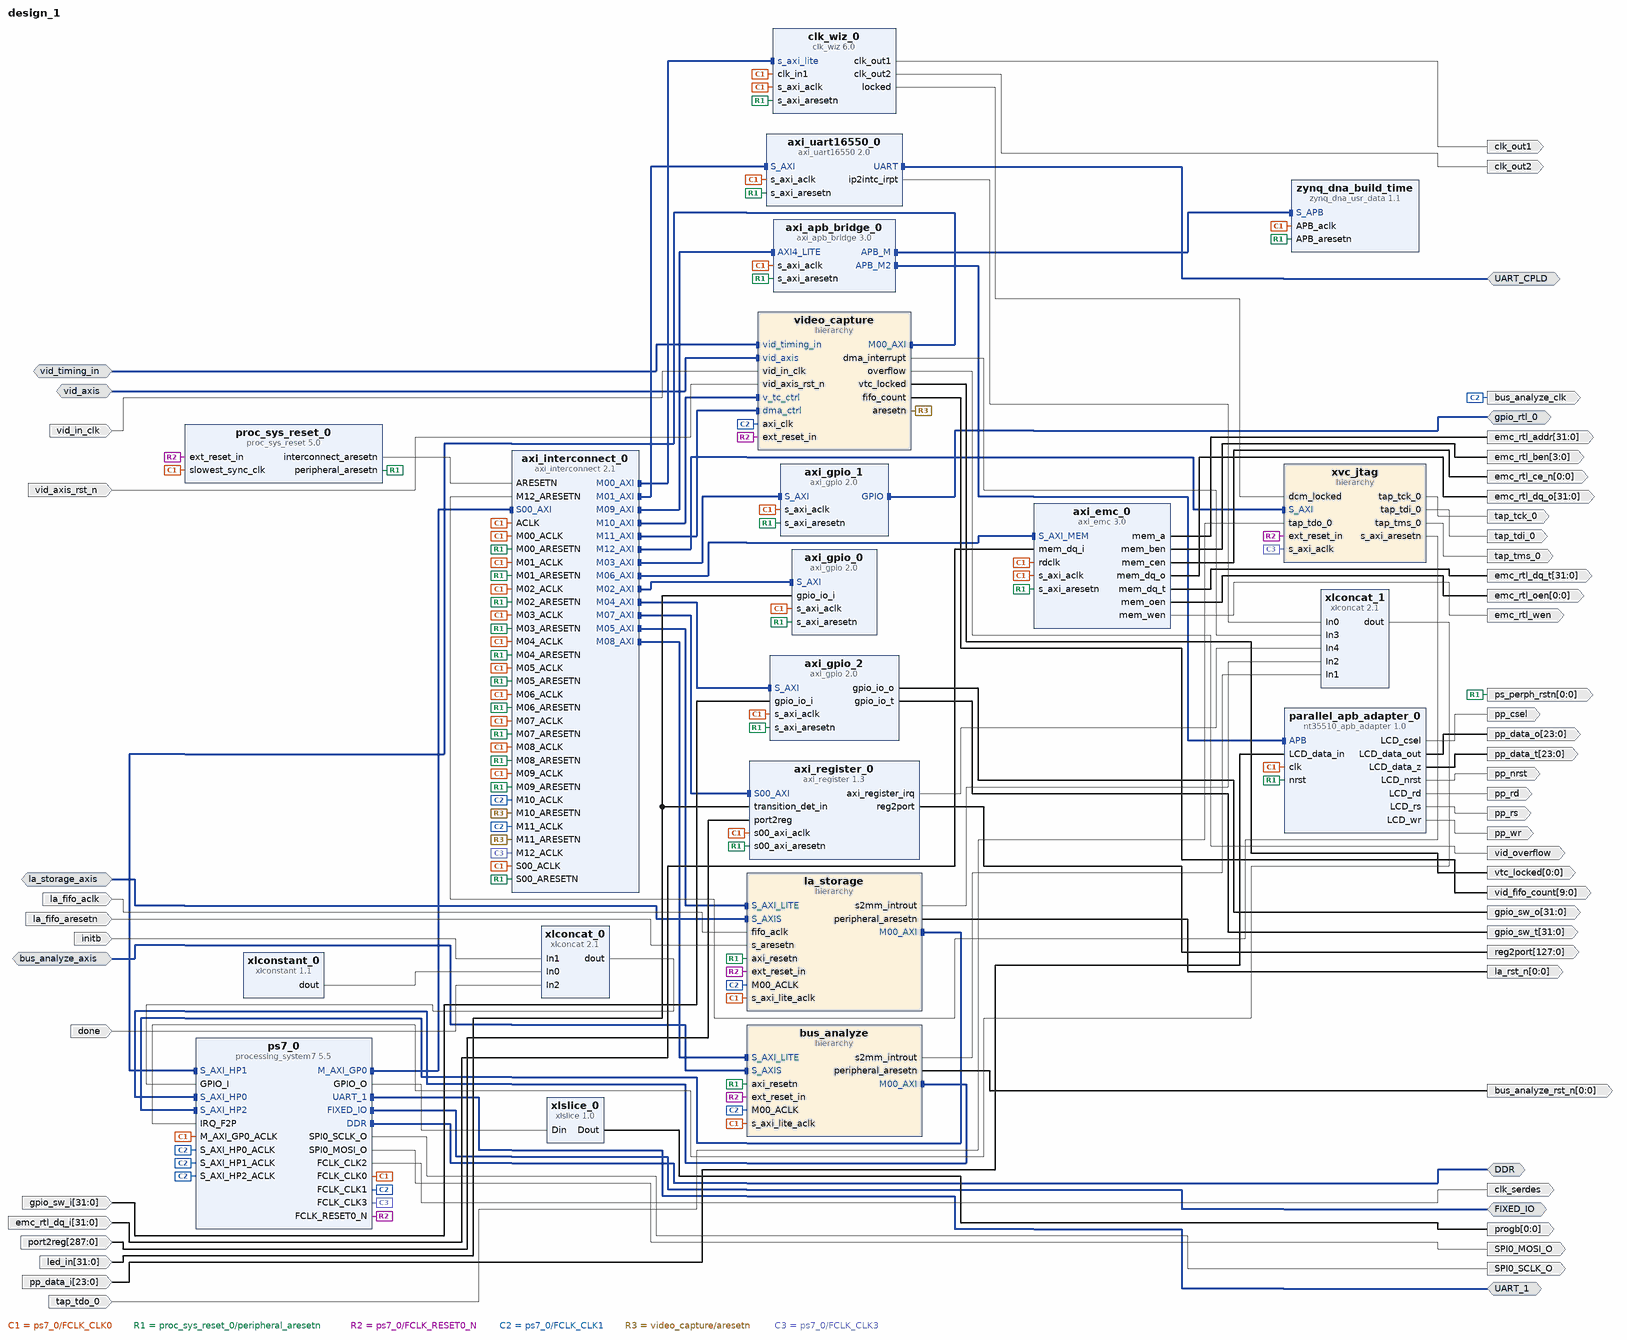
[diagram p0: block diagram of the top level]
# Vivado block design design_1, xc7z020clg484-1, Vivado 2018.3
create_bd_design design_1

create_bd_intf_port -mode Master -vlnv xilinx.com:interface:ddrx_rtl:1.0 DDR
create_bd_intf_port -mode Master -vlnv xilinx.com:display_processing_system7:fixedio_rtl:1.0 FIXED_IO
create_bd_intf_port -mode Master -vlnv xilinx.com:interface:uart_rtl:1.0 UART_1
create_bd_intf_port -mode Master -vlnv xilinx.com:interface:gpio_rtl:1.0 gpio_rtl_0
create_bd_intf_port -mode Slave -vlnv xilinx.com:interface:axis_rtl:1.0 bus_analyze_axis
set_property -dict [list \
  CONFIG.HAS_TKEEP 0 \
  CONFIG.HAS_TLAST 1 \
  CONFIG.HAS_TREADY 1 \
  CONFIG.HAS_TSTRB 0 \
  CONFIG.LAYERED_METADATA undef \
  CONFIG.TDATA_NUM_BYTES 16 \
  CONFIG.TDEST_WIDTH 0 \
  CONFIG.TID_WIDTH 0 \
  CONFIG.TUSER_WIDTH 0 \
] [get_bd_intf_ports bus_analyze_axis]
create_bd_intf_port -mode Slave -vlnv xilinx.com:interface:axis_rtl:1.0 la_storage_axis
set_property -dict [list \
  CONFIG.HAS_TKEEP 0 \
  CONFIG.HAS_TLAST 0 \
  CONFIG.HAS_TREADY 1 \
  CONFIG.HAS_TSTRB 0 \
  CONFIG.LAYERED_METADATA undef \
  CONFIG.TDATA_NUM_BYTES 32 \
  CONFIG.TDEST_WIDTH 0 \
  CONFIG.TID_WIDTH 0 \
  CONFIG.TUSER_WIDTH 0 \
] [get_bd_intf_ports la_storage_axis]
create_bd_intf_port -mode Master -vlnv xilinx.com:interface:uart_rtl:1.0 UART_CPLD
create_bd_intf_port -mode Slave -vlnv xilinx.com:interface:axis_rtl:1.0 vid_axis
set_property -dict [list \
  CONFIG.FREQ_HZ 150000000 \
  CONFIG.HAS_TKEEP 0 \
  CONFIG.HAS_TLAST 1 \
  CONFIG.HAS_TREADY 1 \
  CONFIG.HAS_TSTRB 0 \
  CONFIG.LAYERED_METADATA undef \
  CONFIG.TDATA_NUM_BYTES 1 \
  CONFIG.TDEST_WIDTH 0 \
  CONFIG.TID_WIDTH 0 \
  CONFIG.TUSER_WIDTH 1 \
] [get_bd_intf_ports vid_axis]
create_bd_intf_port -mode Slave -vlnv xilinx.com:interface:video_timing_rtl:2.0 vid_timing_in
create_bd_port -dir O -type clk clk_out1
create_bd_port -dir O -type clk clk_out2
create_bd_port -dir O -from 0 -to 0 ps_perph_rstn
create_bd_port -dir O SPI0_SCLK_O
create_bd_port -dir O -from 0 -to 0 progb
create_bd_port -dir I initb
create_bd_port -dir I done
create_bd_port -dir O SPI0_MOSI_O
create_bd_port -dir O -from 127 -to 0 -type data reg2port
create_bd_port -dir O -type clk bus_analyze_clk
set_property -dict [list \
  CONFIG.ASSOCIATED_BUSIF bus_analyze_axis \
  CONFIG.ASSOCIATED_RESET bus_analyze_rst_n \
] [get_bd_ports bus_analyze_clk]
create_bd_port -dir O -from 31 -to 0 emc_rtl_addr
create_bd_port -dir O -from 3 -to 0 emc_rtl_ben
create_bd_port -dir O -from 0 -to 0 emc_rtl_ce_n
create_bd_port -dir I -from 31 -to 0 emc_rtl_dq_i
create_bd_port -dir O -from 31 -to 0 emc_rtl_dq_o
create_bd_port -dir O -from 31 -to 0 emc_rtl_dq_t
create_bd_port -dir O -from 0 -to 0 emc_rtl_oen
create_bd_port -dir O emc_rtl_wen
create_bd_port -dir O -from 0 -to 0 -type rst bus_analyze_rst_n
create_bd_port -dir O -type clk clk_serdes
create_bd_port -dir I -type clk la_fifo_aclk
create_bd_port -dir I -type rst la_fifo_aresetn
create_bd_port -dir O -from 0 -to 0 -type rst la_rst_n
create_bd_port -dir I -from 287 -to 0 port2reg
create_bd_port -dir I -from 31 -to 0 gpio_sw_i
create_bd_port -dir O -from 31 -to 0 gpio_sw_o
create_bd_port -dir O -from 31 -to 0 gpio_sw_t
create_bd_port -dir O pp_nrst
create_bd_port -dir O pp_csel
create_bd_port -dir O pp_rs
create_bd_port -dir O pp_wr
create_bd_port -dir O pp_rd
create_bd_port -dir O -from 23 -to 0 pp_data_o
create_bd_port -dir O -from 23 -to 0 pp_data_t
create_bd_port -dir I -from 23 -to 0 pp_data_i
create_bd_port -dir I -type clk vid_in_clk
set_property -dict [list \
  CONFIG.ASSOCIATED_BUSIF vid_axis \
  CONFIG.ASSOCIATED_RESET vid_axis_rst_n \
  CONFIG.FREQ_HZ 150000000 \
] [get_bd_ports vid_in_clk]
create_bd_port -dir O vid_overflow
create_bd_port -dir O -from 0 -to 0 vtc_locked
create_bd_port -dir O tap_tdi_0
create_bd_port -dir O tap_tms_0
create_bd_port -dir O tap_tck_0
create_bd_port -dir I tap_tdo_0
create_bd_port -dir I -type rst vid_axis_rst_n
create_bd_port -dir O -from 9 -to 0 vid_fifo_count
create_bd_port -dir I -from 31 -to 0 -type data led_in

create_bd_cell -type hier bus_analyze
create_bd_cell -type hier la_storage
create_bd_cell -type ip -vlnv xilinx.com:ip:xlconcat:2.1 xlconcat_0
set_property -dict {CONFIG.NUM_PORTS 3 CONFIG.dout_width 3} [get_bd_cells xlconcat_0]
create_bd_cell -type ip -vlnv xilinx.com:ip:xlconcat:2.1 xlconcat_1
set_property -dict {CONFIG.NUM_PORTS 5 CONFIG.dout_width 5} [get_bd_cells xlconcat_1]
create_bd_cell -type ip -vlnv xilinx.com:ip:xlslice:1.0 xlslice_0
set_property -dict {CONFIG.DIN_FROM 0 CONFIG.DIN_TO 0 CONFIG.DIN_WIDTH 3} [get_bd_cells xlslice_0]
create_bd_cell -type ip -vlnv user.org:user:nt35510_apb_adapter:1.0 parallel_apb_adapter_0
set_property -dict {CONFIG.NT35510_RD_CYCLE 6 CONFIG.NT35510_RS_CYCLE 2} [get_bd_cells parallel_apb_adapter_0]
create_bd_cell -type hier video_capture
create_bd_cell -type ip -vlnv xilinx.com:ip:processing_system7:5.5 ps7_0
set_property -dict [list \
  CONFIG.PCW_APU_PERIPHERAL_FREQMHZ 666.666666 \
  CONFIG.PCW_ENET0_ENET0_IO {MIO 16 .. 27} \
  CONFIG.PCW_ENET0_GRP_MDIO_ENABLE 1 \
  CONFIG.PCW_ENET0_GRP_MDIO_IO {MIO 52 .. 53} \
  CONFIG.PCW_ENET0_PERIPHERAL_ENABLE 1 \
  CONFIG.PCW_ENET0_RESET_ENABLE 0 \
  CONFIG.PCW_ENET_RESET_ENABLE 1 \
  CONFIG.PCW_ENET_RESET_SELECT {Share reset pin} \
  CONFIG.PCW_EN_CLK1_PORT 1 \
  CONFIG.PCW_EN_CLK2_PORT 1 \
  CONFIG.PCW_EN_CLK3_PORT 1 \
  CONFIG.PCW_FCLK_CLK1_BUF TRUE \
  CONFIG.PCW_FCLK_CLK2_BUF TRUE \
  CONFIG.PCW_FCLK_CLK3_BUF TRUE \
  CONFIG.PCW_FPGA0_PERIPHERAL_FREQMHZ 50 \
  CONFIG.PCW_FPGA1_PERIPHERAL_FREQMHZ 100 \
  CONFIG.PCW_FPGA2_PERIPHERAL_FREQMHZ 200 \
  CONFIG.PCW_FPGA3_PERIPHERAL_FREQMHZ 10 \
  CONFIG.PCW_FPGA_FCLK1_ENABLE 1 \
  CONFIG.PCW_FPGA_FCLK2_ENABLE 1 \
  CONFIG.PCW_FPGA_FCLK3_ENABLE 1 \
  CONFIG.PCW_GP0_EN_MODIFIABLE_TXN 0 \
  CONFIG.PCW_GP1_EN_MODIFIABLE_TXN 0 \
  CONFIG.PCW_GPIO_EMIO_GPIO_ENABLE 1 \
  CONFIG.PCW_GPIO_EMIO_GPIO_IO 3 \
  CONFIG.PCW_GPIO_EMIO_GPIO_WIDTH 3 \
  CONFIG.PCW_GPIO_MIO_GPIO_ENABLE 1 \
  CONFIG.PCW_GPIO_MIO_GPIO_IO MIO \
  CONFIG.PCW_I2C_RESET_ENABLE 1 \
  CONFIG.PCW_IRQ_F2P_INTR 1 \
  CONFIG.PCW_M_AXI_GP0_FREQMHZ 50 \
  CONFIG.PCW_PERIPHERAL_BOARD_PRESET None \
  CONFIG.PCW_PRESET_BANK1_VOLTAGE {LVCMOS 2.5V} \
  CONFIG.PCW_QSPI_GRP_SINGLE_SS_ENABLE 1 \
  CONFIG.PCW_QSPI_GRP_SINGLE_SS_IO {MIO 1 .. 6} \
  CONFIG.PCW_QSPI_PERIPHERAL_ENABLE 1 \
  CONFIG.PCW_QSPI_QSPI_IO {MIO 1 .. 6} \
  CONFIG.PCW_SD0_GRP_CD_ENABLE 1 \
  CONFIG.PCW_SD0_GRP_CD_IO {MIO 48} \
  CONFIG.PCW_SD0_GRP_WP_ENABLE 0 \
  CONFIG.PCW_SD0_PERIPHERAL_ENABLE 1 \
  CONFIG.PCW_SD0_SD0_IO {MIO 40 .. 45} \
  CONFIG.PCW_SDIO_PERIPHERAL_FREQMHZ 50 \
  CONFIG.PCW_SINGLE_QSPI_DATA_MODE x4 \
  CONFIG.PCW_SPI0_PERIPHERAL_ENABLE 1 \
  CONFIG.PCW_SPI0_SPI0_IO EMIO \
  CONFIG.PCW_SPI_PERIPHERAL_FREQMHZ 166.666672 \
  CONFIG.PCW_S_AXI_HP0_FREQMHZ 100 \
  CONFIG.PCW_S_AXI_HP1_FREQMHZ 100 \
  CONFIG.PCW_S_AXI_HP2_FREQMHZ 100 \
  CONFIG.PCW_UART0_PERIPHERAL_ENABLE 1 \
  CONFIG.PCW_UART0_UART0_IO {MIO 46 .. 47} \
  CONFIG.PCW_UART1_PERIPHERAL_ENABLE 1 \
  CONFIG.PCW_UART1_UART1_IO EMIO \
  CONFIG.PCW_UART_PERIPHERAL_FREQMHZ 100 \
  CONFIG.PCW_UIPARAM_DDR_BUS_WIDTH {16 Bit} \
  CONFIG.PCW_UIPARAM_DDR_FREQ_MHZ 533.333333 \
  CONFIG.PCW_UIPARAM_DDR_MEMORY_TYPE {DDR 3 (Low Voltage)} \
  CONFIG.PCW_UIPARAM_DDR_PARTNO {MT41K256M16 RE-125} \
  CONFIG.PCW_USB0_PERIPHERAL_ENABLE 1 \
  CONFIG.PCW_USB0_RESET_ENABLE 1 \
  CONFIG.PCW_USB0_RESET_IO {MIO 49} \
  CONFIG.PCW_USB0_USB0_IO {MIO 28 .. 39} \
  CONFIG.PCW_USB_RESET_ENABLE 1 \
  CONFIG.PCW_USB_RESET_SELECT {Share reset pin} \
  CONFIG.PCW_USE_FABRIC_INTERRUPT 1 \
  CONFIG.PCW_USE_S_AXI_HP0 1 \
  CONFIG.PCW_USE_S_AXI_HP1 1 \
  CONFIG.PCW_USE_S_AXI_HP2 1 \
] [get_bd_cells ps7_0]
# 511 more settings of ps7_0 are not shown: defaults, MIO pin electricals, DDR timing, and values the tool derives
create_bd_cell -type hier xvc_jtag
create_bd_cell -type ip -vlnv xilinx.com:ip:axi_emc:3.0 axi_emc_0
set_property -dict [list \
  CONFIG.C_INCLUDE_DATAWIDTH_MATCHING_0 0 \
  CONFIG.C_MAX_MEM_WIDTH 32 \
  CONFIG.C_MEM0_TYPE 1 \
  CONFIG.C_MEM0_WIDTH 32 \
  CONFIG.C_S_AXI_EN_REG 0 \
] [get_bd_cells axi_emc_0]
create_bd_cell -type ip -vlnv xilinx.com:ip:axi_gpio:2.0 axi_gpio_0
set_property -dict [list \
  CONFIG.C_ALL_INPUTS 0 \
  CONFIG.C_ALL_OUTPUTS 0 \
  CONFIG.C_INTERRUPT_PRESENT 0 \
  CONFIG.C_IS_DUAL 0 \
] [get_bd_cells axi_gpio_0]
create_bd_cell -type ip -vlnv xilinx.com:ip:axi_gpio:2.0 axi_gpio_1
set_property -dict [list \
  CONFIG.C_ALL_INPUTS 0 \
  CONFIG.C_ALL_OUTPUTS 0 \
  CONFIG.C_GPIO_WIDTH 6 \
  CONFIG.C_INTERRUPT_PRESENT 0 \
  CONFIG.C_IS_DUAL 0 \
] [get_bd_cells axi_gpio_1]
create_bd_cell -type ip -vlnv xilinx.com:ip:axi_gpio:2.0 axi_gpio_2
set_property -dict [list \
  CONFIG.C_ALL_INPUTS 0 \
  CONFIG.C_ALL_OUTPUTS 0 \
  CONFIG.C_INTERRUPT_PRESENT 0 \
  CONFIG.C_IS_DUAL 0 \
] [get_bd_cells axi_gpio_2]
create_bd_cell -type ip -vlnv xilinx.com:ip:axi_interconnect:2.1 axi_interconnect_0
set_property -dict {CONFIG.NUM_MI 13 CONFIG.SYNCHRONIZATION_STAGES 2} [get_bd_cells axi_interconnect_0]
create_bd_cell -type ip -vlnv xilinx.com:ip:axi_uart16550:2.0 axi_uart16550_0
set_property -dict {CONFIG.C_S_AXI_ACLK_FREQ_HZ 50000000} [get_bd_cells axi_uart16550_0]
create_bd_cell -type ip -vlnv xilinx.com:ip:clk_wiz:6.0 clk_wiz_0
set_property -dict [list \
  CONFIG.CLKIN1_JITTER_PS 200.0 \
  CONFIG.CLKOUT1_DRIVES BUFGCE \
  CONFIG.CLKOUT1_JITTER 190.710 \
  CONFIG.CLKOUT1_PHASE_ERROR 163.922 \
  CONFIG.CLKOUT1_REQUESTED_OUT_FREQ 50 \
  CONFIG.CLKOUT2_DRIVES BUFGCE \
  CONFIG.CLKOUT2_JITTER 278.968 \
  CONFIG.CLKOUT2_PHASE_ERROR 163.922 \
  CONFIG.CLKOUT2_REQUESTED_OUT_FREQ 11.0592 \
  CONFIG.CLKOUT2_USED true \
  CONFIG.CLKOUT3_DRIVES BUFGCE \
  CONFIG.CLKOUT3_JITTER 264.801 \
  CONFIG.CLKOUT3_PHASE_ERROR 158.301 \
  CONFIG.CLKOUT3_REQUESTED_OUT_FREQ 11.0592 \
  CONFIG.CLKOUT3_USED false \
  CONFIG.CLKOUT4_DRIVES BUFGCE \
  CONFIG.CLKOUT5_DRIVES BUFGCE \
  CONFIG.CLKOUT6_DRIVES BUFGCE \
  CONFIG.CLKOUT7_DRIVES BUFGCE \
  CONFIG.FEEDBACK_SOURCE FDBK_AUTO \
  CONFIG.MMCM_CLKFBOUT_MULT_F 20.125 \
  CONFIG.MMCM_CLKIN1_PERIOD 20.000 \
  CONFIG.MMCM_CLKIN2_PERIOD 10.0 \
  CONFIG.MMCM_CLKOUT0_DIVIDE_F 20.125 \
  CONFIG.MMCM_CLKOUT1_DIVIDE 91 \
  CONFIG.MMCM_CLKOUT2_DIVIDE 1 \
  CONFIG.MMCM_COMPENSATION ZHOLD \
  CONFIG.MMCM_DIVCLK_DIVIDE 1 \
  CONFIG.NUM_OUT_CLKS 2 \
  CONFIG.PRIMITIVE MMCM \
  CONFIG.PRIM_SOURCE Global_buffer \
  CONFIG.USE_DYN_RECONFIG true \
  CONFIG.USE_SAFE_CLOCK_STARTUP true \
] [get_bd_cells clk_wiz_0]
create_bd_cell -type ip -vlnv xilinx.com:ip:proc_sys_reset:5.0 proc_sys_reset_0
create_bd_cell -type ip -vlnv xilinx.com:ip:xlconstant:1.1 xlconstant_0
set_property -dict {CONFIG.CONST_VAL 0} [get_bd_cells xlconstant_0]
create_bd_cell -type ip -vlnv user.org:user:zynq_dna_usr_data:1.1 zynq_dna_build_time
create_bd_cell -type ip -vlnv xilinx.com:ip:axi_apb_bridge:3.0 axi_apb_bridge_0
set_property -dict [list \
  CONFIG.C_APB_NUM_SLAVES 2 \
  CONFIG.C_DPHASE_TIMEOUT 64 \
  CONFIG.C_M_APB_PROTOCOL apb4 \
] [get_bd_cells axi_apb_bridge_0]
create_bd_cell -type ip -vlnv user.org:user:axi_register:1.3 axi_register_0

# ---- hierarchy /bus_analyze ----
current_bd_instance /bus_analyze
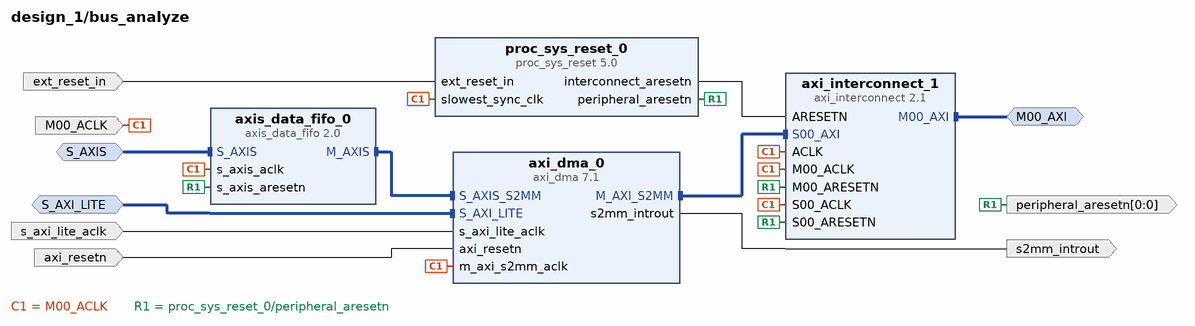
[diagram p1: block diagram inside /bus_analyze]
create_bd_intf_pin -mode Master -vlnv xilinx.com:interface:aximm_rtl:1.0 M00_AXI
create_bd_intf_pin -mode Slave -vlnv xilinx.com:interface:aximm_rtl:1.0 S_AXI_LITE
create_bd_intf_pin -mode Slave -vlnv xilinx.com:interface:axis_rtl:1.0 S_AXIS
create_bd_pin -dir I -type clk M00_ACLK
create_bd_pin -dir I -type clk s_axi_lite_aclk
create_bd_pin -dir I -type rst ext_reset_in
create_bd_pin -dir O -type intr s2mm_introut
create_bd_pin -dir I -type rst axi_resetn
create_bd_pin -dir O -from 0 -to 0 -type rst peripheral_aresetn

create_bd_cell -type ip -vlnv xilinx.com:ip:axi_dma:7.1 axi_dma_0
set_property -dict [list \
  CONFIG.c_include_mm2s 0 \
  CONFIG.c_include_s2mm 1 \
  CONFIG.c_include_sg 0 \
  CONFIG.c_m_axi_s2mm_data_width 128 \
  CONFIG.c_micro_dma 0 \
  CONFIG.c_s2mm_burst_size 32 \
  CONFIG.c_sg_length_width 23 \
] [get_bd_cells axi_dma_0]
create_bd_cell -type ip -vlnv xilinx.com:ip:axi_interconnect:2.1 axi_interconnect_1
set_property -dict {CONFIG.NUM_MI 1 CONFIG.NUM_SI 1 CONFIG.SYNCHRONIZATION_STAGES 2} [get_bd_cells axi_interconnect_1]
create_bd_cell -type ip -vlnv xilinx.com:ip:axis_data_fifo:2.0 axis_data_fifo_0
set_property -dict [list \
  CONFIG.FIFO_DEPTH 256 \
  CONFIG.HAS_RD_DATA_COUNT 1 \
  CONFIG.HAS_TKEEP 0 \
  CONFIG.HAS_WR_DATA_COUNT 1 \
  CONFIG.TDATA_NUM_BYTES 16 \
] [get_bd_cells axis_data_fifo_0]
create_bd_cell -type ip -vlnv xilinx.com:ip:proc_sys_reset:5.0 proc_sys_reset_0

# ---- hierarchy /la_storage ----
current_bd_instance /la_storage
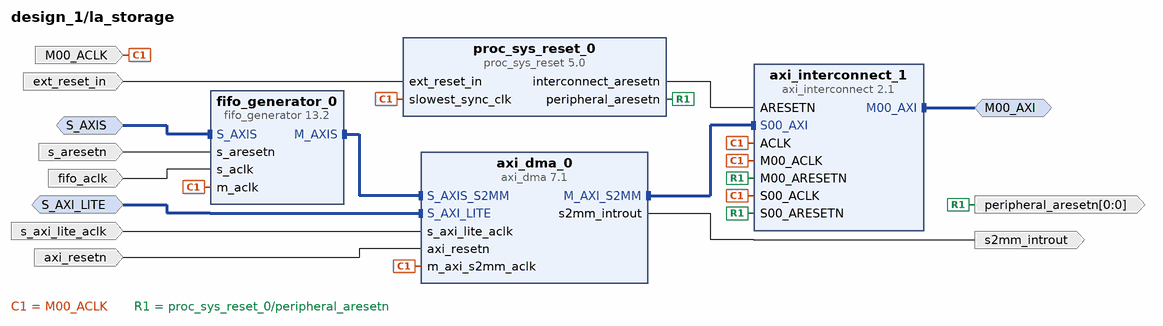
[diagram p2: block diagram inside /la_storage]
create_bd_intf_pin -mode Master -vlnv xilinx.com:interface:aximm_rtl:1.0 M00_AXI
create_bd_intf_pin -mode Slave -vlnv xilinx.com:interface:aximm_rtl:1.0 S_AXI_LITE
create_bd_intf_pin -mode Slave -vlnv xilinx.com:interface:axis_rtl:1.0 S_AXIS
create_bd_pin -dir I -type clk M00_ACLK
create_bd_pin -dir I -type clk s_axi_lite_aclk
create_bd_pin -dir I -type rst ext_reset_in
create_bd_pin -dir O -type intr s2mm_introut
create_bd_pin -dir I -type rst axi_resetn
create_bd_pin -dir O -from 0 -to 0 -type rst peripheral_aresetn
create_bd_pin -dir I -type clk fifo_aclk
create_bd_pin -dir I -type rst s_aresetn

create_bd_cell -type ip -vlnv xilinx.com:ip:axi_dma:7.1 axi_dma_0
set_property -dict [list \
  CONFIG.c_include_mm2s 0 \
  CONFIG.c_include_s2mm 1 \
  CONFIG.c_include_sg 0 \
  CONFIG.c_micro_dma 0 \
  CONFIG.c_s2mm_burst_size 32 \
  CONFIG.c_sg_length_width 23 \
] [get_bd_cells axi_dma_0]
create_bd_cell -type ip -vlnv xilinx.com:ip:axi_interconnect:2.1 axi_interconnect_1
set_property -dict {CONFIG.NUM_MI 1 CONFIG.NUM_SI 1 CONFIG.SYNCHRONIZATION_STAGES 2} [get_bd_cells axi_interconnect_1]
create_bd_cell -type ip -vlnv xilinx.com:ip:fifo_generator:13.2 fifo_generator_0
set_property -dict [list \
  CONFIG.Clock_Type_AXI Independent_Clock \
  CONFIG.Enable_TLAST true \
  CONFIG.FIFO_Implementation_axis Independent_Clocks_Block_RAM \
  CONFIG.FIFO_Implementation_rach Independent_Clocks_Distributed_RAM \
  CONFIG.FIFO_Implementation_rdch Independent_Clocks_Block_RAM \
  CONFIG.FIFO_Implementation_wach Independent_Clocks_Distributed_RAM \
  CONFIG.FIFO_Implementation_wdch Independent_Clocks_Block_RAM \
  CONFIG.FIFO_Implementation_wrch Independent_Clocks_Distributed_RAM \
  CONFIG.Full_Flags_Reset_Value 1 \
  CONFIG.INTERFACE_TYPE AXI_STREAM \
  CONFIG.Input_Depth_axis 1024 \
  CONFIG.TDATA_NUM_BYTES 32 \
  CONFIG.TUSER_WIDTH 0 \
] [get_bd_cells fifo_generator_0]
create_bd_cell -type ip -vlnv xilinx.com:ip:proc_sys_reset:5.0 proc_sys_reset_0

# ---- hierarchy /video_capture ----
current_bd_instance /video_capture
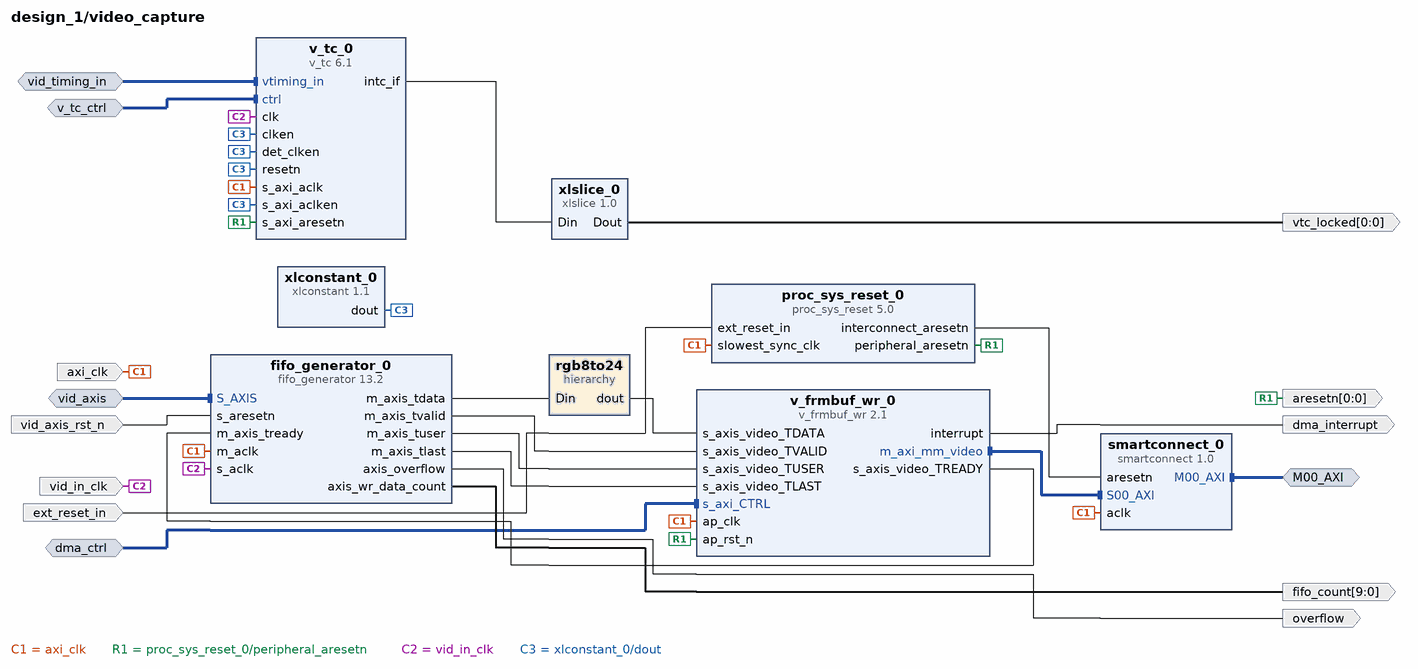
[diagram p3: block diagram inside /video_capture]
create_bd_intf_pin -mode Master -vlnv xilinx.com:interface:aximm_rtl:1.0 M00_AXI
create_bd_intf_pin -mode Slave -vlnv xilinx.com:interface:aximm_rtl:1.0 v_tc_ctrl
create_bd_intf_pin -mode Slave -vlnv xilinx.com:interface:aximm_rtl:1.0 dma_ctrl
create_bd_intf_pin -mode Slave -vlnv xilinx.com:interface:axis_rtl:1.0 vid_axis
create_bd_intf_pin -mode Slave -vlnv xilinx.com:interface:video_timing_rtl:2.0 vid_timing_in
create_bd_pin -dir I axi_clk
create_bd_pin -dir I vid_in_clk
create_bd_pin -dir O dma_interrupt
create_bd_pin -dir O -from 0 -to 0 aresetn
create_bd_pin -dir I ext_reset_in
create_bd_pin -dir O overflow
create_bd_pin -dir O -from 0 -to 0 vtc_locked
create_bd_pin -dir I -type rst vid_axis_rst_n
create_bd_pin -dir O -from 9 -to 0 fifo_count

create_bd_cell -type ip -vlnv xilinx.com:ip:xlslice:1.0 xlslice_0
set_property -dict {CONFIG.DIN_FROM 8 CONFIG.DIN_TO 8 CONFIG.DOUT_WIDTH 1} [get_bd_cells xlslice_0]
create_bd_cell -type hier rgb8to24
create_bd_cell -type ip -vlnv xilinx.com:ip:fifo_generator:13.2 fifo_generator_0
set_property -dict [list \
  CONFIG.Clock_Type_AXI Independent_Clock \
  CONFIG.Enable_Data_Counts_axis true \
  CONFIG.Enable_Safety_Circuit true \
  CONFIG.Enable_TLAST true \
  CONFIG.FIFO_Application_Type_axis Data_FIFO \
  CONFIG.FIFO_Implementation_axis Independent_Clocks_Block_RAM \
  CONFIG.FIFO_Implementation_rach Independent_Clocks_Distributed_RAM \
  CONFIG.FIFO_Implementation_rdch Independent_Clocks_Block_RAM \
  CONFIG.FIFO_Implementation_wach Independent_Clocks_Distributed_RAM \
  CONFIG.FIFO_Implementation_wdch Independent_Clocks_Block_RAM \
  CONFIG.FIFO_Implementation_wrch Independent_Clocks_Distributed_RAM \
  CONFIG.Full_Flags_Reset_Value 1 \
  CONFIG.INTERFACE_TYPE AXI_STREAM \
  CONFIG.Input_Depth_axis 512 \
  CONFIG.Overflow_Flag_AXI true \
  CONFIG.TUSER_WIDTH 1 \
] [get_bd_cells fifo_generator_0]
create_bd_cell -type ip -vlnv xilinx.com:ip:proc_sys_reset:5.0 proc_sys_reset_0
create_bd_cell -type ip -vlnv xilinx.com:ip:smartconnect:1.0 smartconnect_0
set_property -dict {CONFIG.NUM_SI 1} [get_bd_cells smartconnect_0]
create_bd_cell -type ip -vlnv xilinx.com:ip:v_frmbuf_wr:2.1 v_frmbuf_wr_0
set_property -dict [list \
  CONFIG.AXIMM_DATA_WIDTH 64 \
  CONFIG.C_M_AXI_MM_VIDEO_DATA_WIDTH 64 \
  CONFIG.MAX_COLS 2048 \
  CONFIG.MAX_ROWS 2018 \
  CONFIG.SAMPLES_PER_CLOCK 1 \
] [get_bd_cells v_frmbuf_wr_0]
create_bd_cell -type ip -vlnv xilinx.com:ip:v_tc:6.1 v_tc_0
set_property -dict [list \
  CONFIG.HAS_INTC_IF true \
  CONFIG.VIDEO_MODE 640x480p \
  CONFIG.enable_generation false \
  CONFIG.frame_syncs 1 \
  CONFIG.horizontal_blank_detection false \
  CONFIG.max_clocks_per_line 2048 \
  CONFIG.max_lines_per_frame 2048 \
  CONFIG.vertical_blank_detection false \
] [get_bd_cells v_tc_0]
create_bd_cell -type ip -vlnv xilinx.com:ip:xlconstant:1.1 xlconstant_0

# ---- hierarchy /video_capture/rgb8to24 ----
current_bd_instance /video_capture/rgb8to24
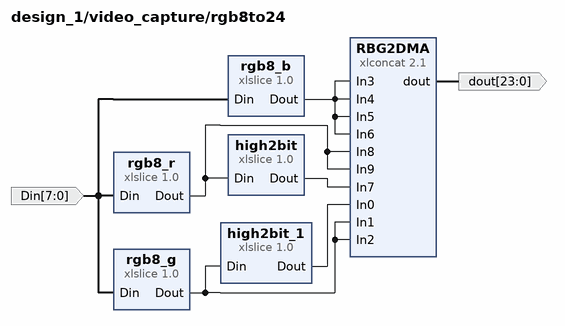
[diagram p4: block diagram inside /video_capture/rgb8to24]
create_bd_pin -dir I -from 7 -to 0 Din
create_bd_pin -dir O -from 23 -to 0 dout

create_bd_cell -type ip -vlnv xilinx.com:ip:xlslice:1.0 rgb8_r
set_property -dict {CONFIG.DIN_FROM 7 CONFIG.DIN_TO 5 CONFIG.DIN_WIDTH 8 CONFIG.DOUT_WIDTH 3} [get_bd_cells rgb8_r]
create_bd_cell -type ip -vlnv xilinx.com:ip:xlslice:1.0 rgb8_g
set_property -dict {CONFIG.DIN_FROM 4 CONFIG.DIN_TO 2 CONFIG.DIN_WIDTH 8 CONFIG.DOUT_WIDTH 3} [get_bd_cells rgb8_g]
create_bd_cell -type ip -vlnv xilinx.com:ip:xlslice:1.0 rgb8_b
set_property -dict {CONFIG.DIN_FROM 1 CONFIG.DIN_TO 0 CONFIG.DIN_WIDTH 8 CONFIG.DOUT_WIDTH 2} [get_bd_cells rgb8_b]
create_bd_cell -type ip -vlnv xilinx.com:ip:xlconcat:2.1 RBG2DMA
set_property -dict {CONFIG.NUM_PORTS 10} [get_bd_cells RBG2DMA]
create_bd_cell -type ip -vlnv xilinx.com:ip:xlslice:1.0 high2bit_1
set_property -dict {CONFIG.DIN_FROM 2 CONFIG.DIN_TO 1 CONFIG.DIN_WIDTH 3 CONFIG.DOUT_WIDTH 2} [get_bd_cells high2bit_1]
create_bd_cell -type ip -vlnv xilinx.com:ip:xlslice:1.0 high2bit
set_property -dict {CONFIG.DIN_FROM 2 CONFIG.DIN_TO 1 CONFIG.DIN_WIDTH 3 CONFIG.DOUT_WIDTH 2} [get_bd_cells high2bit]

# ---- hierarchy /xvc_jtag ----
current_bd_instance /xvc_jtag
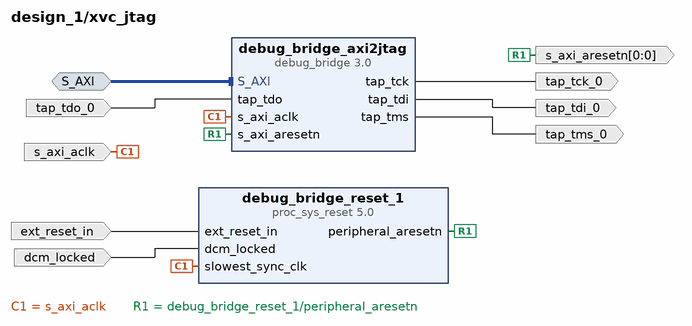
[diagram p5: block diagram inside /xvc_jtag]
create_bd_intf_pin -mode Slave -vlnv xilinx.com:interface:aximm_rtl:1.0 S_AXI
create_bd_pin -dir I -type clk s_axi_aclk
create_bd_pin -dir I -type rst ext_reset_in
create_bd_pin -dir O -from 0 -to 0 -type rst s_axi_aresetn
create_bd_pin -dir O tap_tdi_0
create_bd_pin -dir I tap_tdo_0
create_bd_pin -dir O tap_tms_0
create_bd_pin -dir O tap_tck_0
create_bd_pin -dir I dcm_locked

create_bd_cell -type ip -vlnv xilinx.com:ip:debug_bridge:3.0 debug_bridge_axi2jtag
set_property -dict {CONFIG.C_DEBUG_MODE 3} [get_bd_cells debug_bridge_axi2jtag]
create_bd_cell -type ip -vlnv xilinx.com:ip:proc_sys_reset:5.0 debug_bridge_reset_1

# ---- connections ----

current_bd_instance /bus_analyze
connect_bd_intf_net [get_bd_intf_pins M00_AXI] [get_bd_intf_pins axi_interconnect_1/M00_AXI]
connect_bd_intf_net [get_bd_intf_pins S_AXI_LITE] [get_bd_intf_pins axi_dma_0/S_AXI_LITE]
connect_bd_intf_net [get_bd_intf_pins S_AXIS] [get_bd_intf_pins axis_data_fifo_0/S_AXIS]
connect_bd_intf_net [get_bd_intf_pins axi_interconnect_1/S00_AXI] [get_bd_intf_pins axi_dma_0/M_AXI_S2MM]
connect_bd_intf_net [get_bd_intf_pins axi_dma_0/S_AXIS_S2MM] [get_bd_intf_pins axis_data_fifo_0/M_AXIS]
connect_bd_net -net ps7_0_FCLK_CLK1 [get_bd_pins M00_ACLK] \
  [get_bd_pins axi_dma_0/m_axi_s2mm_aclk] [get_bd_pins axi_interconnect_1/ACLK] [get_bd_pins axi_interconnect_1/S00_ACLK] \
  [get_bd_pins axi_interconnect_1/M00_ACLK] [get_bd_pins axis_data_fifo_0/s_axis_aclk] \
  [get_bd_pins proc_sys_reset_0/slowest_sync_clk]
connect_bd_net [get_bd_pins s_axi_lite_aclk] [get_bd_pins axi_dma_0/s_axi_lite_aclk]
connect_bd_net -net ARESETN_1 [get_bd_pins proc_sys_reset_0/interconnect_aresetn] [get_bd_pins axi_interconnect_1/ARESETN]
connect_bd_net [get_bd_pins proc_sys_reset_0/peripheral_aresetn] \
  [get_bd_pins peripheral_aresetn] [get_bd_pins axi_interconnect_1/S00_ARESETN] [get_bd_pins axi_interconnect_1/M00_ARESETN] \
  [get_bd_pins axis_data_fifo_0/s_axis_aresetn]
connect_bd_net [get_bd_pins ext_reset_in] [get_bd_pins proc_sys_reset_0/ext_reset_in]
connect_bd_net [get_bd_pins axi_dma_0/s2mm_introut] [get_bd_pins s2mm_introut]
connect_bd_net [get_bd_pins axi_resetn] [get_bd_pins axi_dma_0/axi_resetn]

current_bd_instance /la_storage
connect_bd_intf_net [get_bd_intf_pins fifo_generator_0/M_AXIS] [get_bd_intf_pins axi_dma_0/S_AXIS_S2MM]
connect_bd_intf_net [get_bd_intf_pins M00_AXI] [get_bd_intf_pins axi_interconnect_1/M00_AXI]
connect_bd_intf_net [get_bd_intf_pins axi_interconnect_1/S00_AXI] [get_bd_intf_pins axi_dma_0/M_AXI_S2MM]
connect_bd_intf_net [get_bd_intf_pins S_AXIS] [get_bd_intf_pins fifo_generator_0/S_AXIS]
connect_bd_intf_net [get_bd_intf_pins S_AXI_LITE] [get_bd_intf_pins axi_dma_0/S_AXI_LITE]
connect_bd_net -net ps7_0_FCLK_CLK1 [get_bd_pins M00_ACLK] \
  [get_bd_pins axi_dma_0/m_axi_s2mm_aclk] [get_bd_pins axi_interconnect_1/ACLK] [get_bd_pins axi_interconnect_1/S00_ACLK] \
  [get_bd_pins axi_interconnect_1/M00_ACLK] [get_bd_pins fifo_generator_0/m_aclk] \
  [get_bd_pins proc_sys_reset_0/slowest_sync_clk]
connect_bd_net [get_bd_pins s_axi_lite_aclk] [get_bd_pins axi_dma_0/s_axi_lite_aclk]
connect_bd_net -net ARESETN_1 [get_bd_pins proc_sys_reset_0/interconnect_aresetn] [get_bd_pins axi_interconnect_1/ARESETN]
connect_bd_net [get_bd_pins proc_sys_reset_0/peripheral_aresetn] \
  [get_bd_pins peripheral_aresetn] [get_bd_pins axi_interconnect_1/S00_ARESETN] [get_bd_pins axi_interconnect_1/M00_ARESETN]
connect_bd_net [get_bd_pins ext_reset_in] [get_bd_pins proc_sys_reset_0/ext_reset_in]
connect_bd_net [get_bd_pins axi_dma_0/s2mm_introut] [get_bd_pins s2mm_introut]
connect_bd_net [get_bd_pins axi_resetn] [get_bd_pins axi_dma_0/axi_resetn]
connect_bd_net [get_bd_pins s_aresetn] [get_bd_pins fifo_generator_0/s_aresetn]
connect_bd_net -net m_aclk_1 [get_bd_pins fifo_aclk] [get_bd_pins fifo_generator_0/s_aclk]

current_bd_instance /video_capture
connect_bd_intf_net [get_bd_intf_pins vid_axis] [get_bd_intf_pins fifo_generator_0/S_AXIS]
connect_bd_intf_net [get_bd_intf_pins vid_timing_in] [get_bd_intf_pins v_tc_0/vtiming_in]
connect_bd_intf_net [get_bd_intf_pins v_tc_ctrl] [get_bd_intf_pins v_tc_0/ctrl]
connect_bd_intf_net [get_bd_intf_pins M00_AXI] [get_bd_intf_pins smartconnect_0/M00_AXI]
connect_bd_intf_net [get_bd_intf_pins v_frmbuf_wr_0/m_axi_mm_video] [get_bd_intf_pins smartconnect_0/S00_AXI]
connect_bd_intf_net [get_bd_intf_pins dma_ctrl] [get_bd_intf_pins v_frmbuf_wr_0/s_axi_CTRL]
connect_bd_net [get_bd_pins proc_sys_reset_0/interconnect_aresetn] [get_bd_pins smartconnect_0/aresetn]
connect_bd_net [get_bd_pins axi_clk] \
  [get_bd_pins fifo_generator_0/m_aclk] [get_bd_pins proc_sys_reset_0/slowest_sync_clk] [get_bd_pins smartconnect_0/aclk] \
  [get_bd_pins v_frmbuf_wr_0/ap_clk] [get_bd_pins v_tc_0/s_axi_aclk]
connect_bd_net [get_bd_pins proc_sys_reset_0/peripheral_aresetn] \
  [get_bd_pins aresetn] [get_bd_pins v_frmbuf_wr_0/ap_rst_n] [get_bd_pins v_tc_0/s_axi_aresetn]
connect_bd_net [get_bd_pins vid_in_clk] [get_bd_pins fifo_generator_0/s_aclk] [get_bd_pins v_tc_0/clk]
connect_bd_net [get_bd_pins v_frmbuf_wr_0/interrupt] [get_bd_pins dma_interrupt]
connect_bd_net [get_bd_pins xlconstant_0/dout] \
  [get_bd_pins v_tc_0/clken] [get_bd_pins v_tc_0/s_axi_aclken] [get_bd_pins v_tc_0/det_clken] [get_bd_pins v_tc_0/resetn]
connect_bd_net [get_bd_pins ext_reset_in] [get_bd_pins proc_sys_reset_0/ext_reset_in]
connect_bd_net [get_bd_pins v_tc_0/intc_if] [get_bd_pins xlslice_0/Din]
connect_bd_net -net xlslice_0_Dout [get_bd_pins xlslice_0/Dout] [get_bd_pins vtc_locked]
connect_bd_net -net fifo_generator_0_axis_overflow [get_bd_pins fifo_generator_0/axis_overflow] [get_bd_pins overflow]
connect_bd_net [get_bd_pins fifo_generator_0/m_axis_tvalid] [get_bd_pins v_frmbuf_wr_0/s_axis_video_TVALID]
connect_bd_net [get_bd_pins fifo_generator_0/m_axis_tuser] [get_bd_pins v_frmbuf_wr_0/s_axis_video_TUSER]
connect_bd_net [get_bd_pins fifo_generator_0/m_axis_tlast] [get_bd_pins v_frmbuf_wr_0/s_axis_video_TLAST]
connect_bd_net [get_bd_pins v_frmbuf_wr_0/s_axis_video_TREADY] [get_bd_pins fifo_generator_0/m_axis_tready]
connect_bd_net -net s_aresetn_0_1 [get_bd_pins vid_axis_rst_n] [get_bd_pins fifo_generator_0/s_aresetn]
connect_bd_net -net xlconcat_0_dout [get_bd_pins rgb8to24/dout] [get_bd_pins v_frmbuf_wr_0/s_axis_video_TDATA]
connect_bd_net [get_bd_pins fifo_generator_0/m_axis_tdata] [get_bd_pins rgb8to24/Din]
connect_bd_net -net fifo_generator_0_axis_wr_data_count [get_bd_pins fifo_generator_0/axis_wr_data_count] [get_bd_pins fifo_count]
set_property HDL_ATTRIBUTE.DEBUG true [get_bd_nets xlslice_0_Dout]
set_property HDL_ATTRIBUTE.MARK_DEBUG true [get_bd_nets xlslice_0_Dout]
set_property HDL_ATTRIBUTE.DEBUG true [get_bd_nets fifo_generator_0_axis_overflow]
set_property HDL_ATTRIBUTE.DEBUG true [get_bd_nets s_aresetn_0_1]
set_property HDL_ATTRIBUTE.DEBUG true [get_bd_nets fifo_generator_0_axis_wr_data_count]
set_property HDL_ATTRIBUTE.MARK_DEBUG true [get_bd_nets fifo_generator_0_axis_wr_data_count]

current_bd_instance /video_capture/rgb8to24
connect_bd_net -net fifo_generator_0_m_axis_tdata [get_bd_pins Din] [get_bd_pins rgb8_g/Din] [get_bd_pins rgb8_b/Din] [get_bd_pins rgb8_r/Din]
connect_bd_net -net xlconcat_0_dout [get_bd_pins RBG2DMA/dout] [get_bd_pins dout]
connect_bd_net [get_bd_pins rgb8_r/Dout] [get_bd_pins high2bit/Din] [get_bd_pins RBG2DMA/In9] [get_bd_pins RBG2DMA/In8]
connect_bd_net [get_bd_pins high2bit/Dout] [get_bd_pins RBG2DMA/In7]
connect_bd_net -net high2bit1_Dout [get_bd_pins high2bit_1/Dout] [get_bd_pins RBG2DMA/In0]
connect_bd_net [get_bd_pins rgb8_g/Dout] [get_bd_pins RBG2DMA/In1] [get_bd_pins high2bit_1/Din] [get_bd_pins RBG2DMA/In2]
connect_bd_net [get_bd_pins rgb8_b/Dout] [get_bd_pins RBG2DMA/In3] [get_bd_pins RBG2DMA/In4] [get_bd_pins RBG2DMA/In5] [get_bd_pins RBG2DMA/In6]

current_bd_instance /xvc_jtag
connect_bd_intf_net [get_bd_intf_pins S_AXI] [get_bd_intf_pins debug_bridge_axi2jtag/S_AXI]
connect_bd_net -net ps7_0_FCLK_CLK3 [get_bd_pins s_axi_aclk] \
  [get_bd_pins debug_bridge_axi2jtag/s_axi_aclk] [get_bd_pins debug_bridge_reset_1/slowest_sync_clk]
connect_bd_net -net processing_system7_0_FCLK_RESET0_N [get_bd_pins ext_reset_in] [get_bd_pins debug_bridge_reset_1/ext_reset_in]
connect_bd_net [get_bd_pins debug_bridge_reset_1/peripheral_aresetn] [get_bd_pins s_axi_aresetn] [get_bd_pins debug_bridge_axi2jtag/s_axi_aresetn]
connect_bd_net [get_bd_pins debug_bridge_axi2jtag/tap_tdi] [get_bd_pins tap_tdi_0]
connect_bd_net -net tap_tdo_0_1 [get_bd_pins tap_tdo_0] [get_bd_pins debug_bridge_axi2jtag/tap_tdo]
connect_bd_net [get_bd_pins debug_bridge_axi2jtag/tap_tms] [get_bd_pins tap_tms_0]
connect_bd_net [get_bd_pins debug_bridge_axi2jtag/tap_tck] [get_bd_pins tap_tck_0]
connect_bd_net [get_bd_pins dcm_locked] [get_bd_pins debug_bridge_reset_1/dcm_locked]

current_bd_instance /
connect_bd_intf_net [get_bd_intf_pins video_capture/v_tc_ctrl] [get_bd_intf_pins axi_interconnect_0/M10_AXI]
connect_bd_intf_net [get_bd_intf_pins axi_interconnect_0/M02_AXI] [get_bd_intf_pins axi_gpio_0/S_AXI]
connect_bd_intf_net [get_bd_intf_pins video_capture/M00_AXI] [get_bd_intf_pins ps7_0/S_AXI_HP1]
connect_bd_intf_net [get_bd_intf_ports vid_timing_in] [get_bd_intf_pins video_capture/vid_timing_in]
connect_bd_intf_net [get_bd_intf_pins axi_uart16550_0/S_AXI] [get_bd_intf_pins axi_interconnect_0/M01_AXI]
connect_bd_intf_net [get_bd_intf_pins bus_analyze/M00_AXI] [get_bd_intf_pins ps7_0/S_AXI_HP0]
connect_bd_intf_net [get_bd_intf_ports vid_axis] [get_bd_intf_pins video_capture/vid_axis]
connect_bd_intf_net [get_bd_intf_ports UART_CPLD] [get_bd_intf_pins axi_uart16550_0/UART]
connect_bd_intf_net [get_bd_intf_pins axi_interconnect_0/S00_AXI] [get_bd_intf_pins ps7_0/M_AXI_GP0]
connect_bd_intf_net [get_bd_intf_pins axi_interconnect_0/M09_AXI] [get_bd_intf_pins axi_apb_bridge_0/AXI4_LITE]
connect_bd_intf_net [get_bd_intf_pins axi_interconnect_0/M12_AXI] [get_bd_intf_pins xvc_jtag/S_AXI]
connect_bd_intf_net [get_bd_intf_pins axi_apb_bridge_0/APB_M2] [get_bd_intf_pins parallel_apb_adapter_0/APB]
connect_bd_intf_net [get_bd_intf_ports UART_1] [get_bd_intf_pins ps7_0/UART_1]
connect_bd_intf_net [get_bd_intf_pins axi_interconnect_0/M07_AXI] [get_bd_intf_pins axi_register_0/S00_AXI]
connect_bd_intf_net [get_bd_intf_pins axi_apb_bridge_0/APB_M] [get_bd_intf_pins zynq_dna_build_time/S_APB]
connect_bd_intf_net [get_bd_intf_ports bus_analyze_axis] [get_bd_intf_pins bus_analyze/S_AXIS]
connect_bd_intf_net [get_bd_intf_pins axi_interconnect_0/M04_AXI] [get_bd_intf_pins axi_gpio_2/S_AXI]
connect_bd_intf_net [get_bd_intf_ports la_storage_axis] [get_bd_intf_pins la_storage/S_AXIS]
connect_bd_intf_net [get_bd_intf_pins clk_wiz_0/s_axi_lite] [get_bd_intf_pins axi_interconnect_0/M00_AXI]
connect_bd_intf_net [get_bd_intf_pins video_capture/dma_ctrl] [get_bd_intf_pins axi_interconnect_0/M11_AXI]
connect_bd_intf_net [get_bd_intf_pins la_storage/S_AXI_LITE] [get_bd_intf_pins axi_interconnect_0/M05_AXI]
connect_bd_intf_net [get_bd_intf_pins axi_interconnect_0/M06_AXI] [get_bd_intf_pins axi_emc_0/S_AXI_MEM]
connect_bd_intf_net [get_bd_intf_pins axi_interconnect_0/M08_AXI] [get_bd_intf_pins bus_analyze/S_AXI_LITE]
connect_bd_intf_net [get_bd_intf_ports FIXED_IO] [get_bd_intf_pins ps7_0/FIXED_IO]
connect_bd_intf_net [get_bd_intf_ports DDR] [get_bd_intf_pins ps7_0/DDR]
connect_bd_intf_net [get_bd_intf_pins axi_interconnect_0/M03_AXI] [get_bd_intf_pins axi_gpio_1/S_AXI]
connect_bd_intf_net [get_bd_intf_ports gpio_rtl_0] [get_bd_intf_pins axi_gpio_1/GPIO]
connect_bd_intf_net [get_bd_intf_pins la_storage/M00_AXI] [get_bd_intf_pins ps7_0/S_AXI_HP2]
connect_bd_net -net processing_system7_0_FCLK_CLK0 [get_bd_pins ps7_0/FCLK_CLK0] \
  [get_bd_pins parallel_apb_adapter_0/clk] [get_bd_pins ps7_0/M_AXI_GP0_ACLK] [get_bd_pins bus_analyze/s_axi_lite_aclk] \
  [get_bd_pins la_storage/s_axi_lite_aclk] [get_bd_pins axi_emc_0/s_axi_aclk] [get_bd_pins axi_emc_0/rdclk] \
  [get_bd_pins axi_gpio_0/s_axi_aclk] [get_bd_pins axi_gpio_1/s_axi_aclk] [get_bd_pins axi_gpio_2/s_axi_aclk] \
  [get_bd_pins axi_interconnect_0/ACLK] [get_bd_pins axi_interconnect_0/S00_ACLK] [get_bd_pins axi_interconnect_0/M00_ACLK] \
  [get_bd_pins axi_interconnect_0/M01_ACLK] [get_bd_pins axi_interconnect_0/M02_ACLK] \
  [get_bd_pins axi_interconnect_0/M03_ACLK] [get_bd_pins axi_interconnect_0/M04_ACLK] \
  [get_bd_pins axi_interconnect_0/M05_ACLK] [get_bd_pins axi_interconnect_0/M06_ACLK] \
  [get_bd_pins axi_interconnect_0/M07_ACLK] [get_bd_pins axi_interconnect_0/M08_ACLK] \
  [get_bd_pins axi_interconnect_0/M09_ACLK] [get_bd_pins axi_uart16550_0/s_axi_aclk] [get_bd_pins clk_wiz_0/s_axi_aclk] \
  [get_bd_pins clk_wiz_0/clk_in1] [get_bd_pins proc_sys_reset_0/slowest_sync_clk] [get_bd_pins zynq_dna_build_time/APB_aclk] \
  [get_bd_pins axi_apb_bridge_0/s_axi_aclk] [get_bd_pins axi_register_0/s00_axi_aclk]
connect_bd_net [get_bd_pins clk_wiz_0/clk_out1] [get_bd_ports clk_out1]
connect_bd_net [get_bd_pins clk_wiz_0/clk_out2] [get_bd_ports clk_out2]
connect_bd_net [get_bd_pins proc_sys_reset_0/interconnect_aresetn] [get_bd_pins axi_interconnect_0/ARESETN]
connect_bd_net [get_bd_pins proc_sys_reset_0/peripheral_aresetn] \
  [get_bd_ports ps_perph_rstn] [get_bd_pins parallel_apb_adapter_0/nrst] [get_bd_pins bus_analyze/axi_resetn] \
  [get_bd_pins la_storage/axi_resetn] [get_bd_pins axi_emc_0/s_axi_aresetn] [get_bd_pins axi_gpio_0/s_axi_aresetn] \
  [get_bd_pins axi_gpio_1/s_axi_aresetn] [get_bd_pins axi_gpio_2/s_axi_aresetn] [get_bd_pins axi_interconnect_0/S00_ARESETN] \
  [get_bd_pins axi_interconnect_0/M00_ARESETN] [get_bd_pins axi_interconnect_0/M01_ARESETN] \
  [get_bd_pins axi_interconnect_0/M02_ARESETN] [get_bd_pins axi_interconnect_0/M03_ARESETN] \
  [get_bd_pins axi_interconnect_0/M04_ARESETN] [get_bd_pins axi_interconnect_0/M05_ARESETN] \
  [get_bd_pins axi_interconnect_0/M06_ARESETN] [get_bd_pins axi_interconnect_0/M07_ARESETN] \
  [get_bd_pins axi_interconnect_0/M08_ARESETN] [get_bd_pins axi_interconnect_0/M09_ARESETN] \
  [get_bd_pins axi_uart16550_0/s_axi_aresetn] [get_bd_pins clk_wiz_0/s_axi_aresetn] \
  [get_bd_pins zynq_dna_build_time/APB_aresetn] [get_bd_pins axi_apb_bridge_0/s_axi_aresetn] \
  [get_bd_pins axi_register_0/s00_axi_aresetn]
connect_bd_net -net processing_system7_0_FCLK_RESET0_N [get_bd_pins ps7_0/FCLK_RESET0_N] \
  [get_bd_pins bus_analyze/ext_reset_in] [get_bd_pins la_storage/ext_reset_in] [get_bd_pins video_capture/ext_reset_in] \
  [get_bd_pins xvc_jtag/ext_reset_in] [get_bd_pins proc_sys_reset_0/ext_reset_in]
connect_bd_net [get_bd_pins ps7_0/SPI0_SCLK_O] [get_bd_ports SPI0_SCLK_O]
connect_bd_net [get_bd_pins ps7_0/GPIO_O] [get_bd_pins xlslice_0/Din]
connect_bd_net [get_bd_pins xlslice_0/Dout] [get_bd_ports progb]
connect_bd_net [get_bd_pins xlconcat_0/dout] [get_bd_pins ps7_0/GPIO_I]
connect_bd_net [get_bd_ports initb] [get_bd_pins xlconcat_0/In1]
connect_bd_net [get_bd_ports done] [get_bd_pins xlconcat_0/In2]
connect_bd_net [get_bd_pins xlconstant_0/dout] [get_bd_pins xlconcat_0/In0]
connect_bd_net [get_bd_pins ps7_0/SPI0_MOSI_O] [get_bd_ports SPI0_MOSI_O]
connect_bd_net [get_bd_pins axi_register_0/reg2port] [get_bd_ports reg2port]
connect_bd_net [get_bd_pins ps7_0/FCLK_CLK1] \
  [get_bd_ports bus_analyze_clk] [get_bd_pins ps7_0/S_AXI_HP0_ACLK] [get_bd_pins ps7_0/S_AXI_HP1_ACLK] \
  [get_bd_pins ps7_0/S_AXI_HP2_ACLK] [get_bd_pins bus_analyze/M00_ACLK] [get_bd_pins la_storage/M00_ACLK] \
  [get_bd_pins video_capture/axi_clk] [get_bd_pins axi_interconnect_0/M10_ACLK] [get_bd_pins axi_interconnect_0/M11_ACLK]
connect_bd_net [get_bd_pins xlconcat_1/dout] [get_bd_pins ps7_0/IRQ_F2P]
connect_bd_net [get_bd_pins bus_analyze/s2mm_introut] [get_bd_pins xlconcat_1/In1]
connect_bd_net [get_bd_pins axi_emc_0/mem_a] [get_bd_ports emc_rtl_addr]
connect_bd_net [get_bd_pins axi_emc_0/mem_ben] [get_bd_ports emc_rtl_ben]
connect_bd_net [get_bd_pins axi_emc_0/mem_cen] [get_bd_ports emc_rtl_ce_n]
connect_bd_net -net mem_dq_i_1 [get_bd_ports emc_rtl_dq_i] [get_bd_pins axi_emc_0/mem_dq_i]
connect_bd_net [get_bd_pins axi_emc_0/mem_dq_o] [get_bd_ports emc_rtl_dq_o]
connect_bd_net [get_bd_pins axi_emc_0/mem_dq_t] [get_bd_ports emc_rtl_dq_t]
connect_bd_net [get_bd_pins axi_emc_0/mem_oen] [get_bd_ports emc_rtl_oen]
connect_bd_net [get_bd_pins axi_emc_0/mem_wen] [get_bd_ports emc_rtl_wen]
connect_bd_net [get_bd_pins bus_analyze/peripheral_aresetn] [get_bd_ports bus_analyze_rst_n]
connect_bd_net [get_bd_pins ps7_0/FCLK_CLK2] [get_bd_ports clk_serdes]
connect_bd_net -net m_aclk_1 [get_bd_ports la_fifo_aclk] [get_bd_pins la_storage/fifo_aclk]
connect_bd_net -net s_aresetn_1 [get_bd_ports la_fifo_aresetn] [get_bd_pins la_storage/s_aresetn]
connect_bd_net [get_bd_pins la_storage/s2mm_introut] [get_bd_pins xlconcat_1/In2]
connect_bd_net [get_bd_pins la_storage/peripheral_aresetn] [get_bd_ports la_rst_n]
connect_bd_net [get_bd_ports port2reg] [get_bd_pins axi_register_0/port2reg]
connect_bd_net -net gpio_io_i_1 [get_bd_ports gpio_sw_i] [get_bd_pins axi_gpio_2/gpio_io_i]
connect_bd_net [get_bd_pins axi_gpio_2/gpio_io_o] [get_bd_ports gpio_sw_o]
connect_bd_net [get_bd_pins axi_gpio_2/gpio_io_t] [get_bd_ports gpio_sw_t]
connect_bd_net -net nt35510_apb_adapter_0_LCD_nrst [get_bd_pins parallel_apb_adapter_0/LCD_nrst] [get_bd_ports pp_nrst]
connect_bd_net -net nt35510_apb_adapter_0_LCD_csel [get_bd_pins parallel_apb_adapter_0/LCD_csel] [get_bd_ports pp_csel]
connect_bd_net -net nt35510_apb_adapter_0_LCD_rs [get_bd_pins parallel_apb_adapter_0/LCD_rs] [get_bd_ports pp_rs]
connect_bd_net -net nt35510_apb_adapter_0_LCD_wr [get_bd_pins parallel_apb_adapter_0/LCD_wr] [get_bd_ports pp_wr]
connect_bd_net -net nt35510_apb_adapter_0_LCD_rd [get_bd_pins parallel_apb_adapter_0/LCD_rd] [get_bd_ports pp_rd]
connect_bd_net [get_bd_pins parallel_apb_adapter_0/LCD_data_out] [get_bd_ports pp_data_o]
connect_bd_net [get_bd_pins parallel_apb_adapter_0/LCD_data_z] [get_bd_ports pp_data_t]
connect_bd_net -net LCD_data_in_1 [get_bd_ports pp_data_i] [get_bd_pins parallel_apb_adapter_0/LCD_data_in]
connect_bd_net [get_bd_pins axi_uart16550_0/ip2intc_irpt] [get_bd_pins xlconcat_1/In0]
connect_bd_net [get_bd_ports vid_in_clk] [get_bd_pins video_capture/vid_in_clk]
connect_bd_net [get_bd_pins video_capture/aresetn] [get_bd_pins axi_interconnect_0/M10_ARESETN] [get_bd_pins axi_interconnect_0/M11_ARESETN]
connect_bd_net [get_bd_pins video_capture/dma_interrupt] [get_bd_pins xlconcat_1/In3]
connect_bd_net -net video_capture_overflow [get_bd_pins video_capture/overflow] [get_bd_ports vid_overflow]
connect_bd_net -net video_capture_vtc_locked [get_bd_pins video_capture/vtc_locked] [get_bd_ports vtc_locked]
connect_bd_net -net debug_bridge_axi2jtag_tap_tdi [get_bd_pins xvc_jtag/tap_tdi_0] [get_bd_ports tap_tdi_0]
connect_bd_net -net debug_bridge_axi2jtag_tap_tms [get_bd_pins xvc_jtag/tap_tms_0] [get_bd_ports tap_tms_0]
connect_bd_net -net debug_bridge_axi2jtag_tap_tck [get_bd_pins xvc_jtag/tap_tck_0] [get_bd_ports tap_tck_0]
connect_bd_net -net tap_tdo_0_1 [get_bd_ports tap_tdo_0] [get_bd_pins xvc_jtag/tap_tdo_0]
connect_bd_net -net s_aresetn_0_1 [get_bd_ports vid_axis_rst_n] [get_bd_pins video_capture/vid_axis_rst_n]
connect_bd_net -net video_capture_axis_wr_data_count_0 [get_bd_pins video_capture/fifo_count] [get_bd_ports vid_fifo_count]
connect_bd_net -net debug_bridge_reset_1_peripheral_aresetn [get_bd_pins xvc_jtag/s_axi_aresetn] [get_bd_pins axi_interconnect_0/M12_ARESETN]
connect_bd_net [get_bd_pins clk_wiz_0/locked] [get_bd_pins xvc_jtag/dcm_locked]
connect_bd_net -net s_axi_aclk_1 [get_bd_pins ps7_0/FCLK_CLK3] [get_bd_pins xvc_jtag/s_axi_aclk] [get_bd_pins axi_interconnect_0/M12_ACLK]
connect_bd_net -net axi_register_0_irq [get_bd_pins axi_register_0/axi_register_irq] [get_bd_pins xlconcat_1/In4]
connect_bd_net [get_bd_ports led_in] [get_bd_pins axi_gpio_0/gpio_io_i] [get_bd_pins axi_register_0/transition_det_in]
set_property HDL_ATTRIBUTE.DEBUG true [get_bd_nets video_capture_overflow]
set_property HDL_ATTRIBUTE.DEBUG true [get_bd_nets video_capture_vtc_locked]
set_property HDL_ATTRIBUTE.DEBUG true [get_bd_nets s_aresetn_0_1]
set_property HDL_ATTRIBUTE.MARK_DEBUG true [get_bd_nets s_aresetn_0_1]
set_property HDL_ATTRIBUTE.DEBUG true [get_bd_nets video_capture_axis_wr_data_count_0]
set_property HDL_ATTRIBUTE.DEBUG true [get_bd_nets axi_register_0_irq]
set_property HDL_ATTRIBUTE.MARK_DEBUG true [get_bd_nets axi_register_0_irq]

# ---- address map ----
assign_bd_address -offset 0x00000000 -range 512M -target_address_space [get_bd_addr_spaces bus_analyze/axi_dma_0/Data_S2MM] [get_bd_addr_segs ps7_0/S_AXI_HP0/HP0_DDR_LOWOCM]
assign_bd_address -offset 0x00000000 -range 512M -target_address_space [get_bd_addr_spaces la_storage/axi_dma_0/Data_S2MM] [get_bd_addr_segs ps7_0/S_AXI_HP2/HP2_DDR_LOWOCM]
assign_bd_address -offset 0x41200000 -range 64K -target_address_space [get_bd_addr_spaces ps7_0/Data] [get_bd_addr_segs axi_gpio_0/S_AXI/Reg]
assign_bd_address -offset 0x41210000 -range 64K -target_address_space [get_bd_addr_spaces ps7_0/Data] [get_bd_addr_segs axi_gpio_1/S_AXI/Reg]
assign_bd_address -offset 0x41220000 -range 64K -target_address_space [get_bd_addr_spaces ps7_0/Data] [get_bd_addr_segs axi_gpio_2/S_AXI/Reg]
assign_bd_address -offset 0x41230000 -range 4K -target_address_space [get_bd_addr_spaces ps7_0/Data] [get_bd_addr_segs parallel_apb_adapter_0/APB/Ctrl]
assign_bd_address -offset 0x41231000 -range 4K -target_address_space [get_bd_addr_spaces ps7_0/Data] [get_bd_addr_segs zynq_dna_build_time/S_APB/reg]
assign_bd_address -offset 0x43C00000 -range 64K -target_address_space [get_bd_addr_spaces ps7_0/Data] [get_bd_addr_segs clk_wiz_0/s_axi_lite/Reg]
assign_bd_address -offset 0x43C10000 -range 4K -target_address_space [get_bd_addr_spaces ps7_0/Data] [get_bd_addr_segs axi_register_0/S00_AXI/S00_AXI_reg]
assign_bd_address -offset 0x43C11000 -range 4K -target_address_space [get_bd_addr_spaces ps7_0/Data] [get_bd_addr_segs bus_analyze/axi_dma_0/S_AXI_LITE/Reg]
assign_bd_address -offset 0x43C12000 -range 4K -target_address_space [get_bd_addr_spaces ps7_0/Data] [get_bd_addr_segs la_storage/axi_dma_0/S_AXI_LITE/Reg]
assign_bd_address -offset 0x43C13000 -range 4K -target_address_space [get_bd_addr_spaces ps7_0/Data] [get_bd_addr_segs video_capture/v_frmbuf_wr_0/s_axi_CTRL/Reg]
assign_bd_address -offset 0x43C14000 -range 4K -target_address_space [get_bd_addr_spaces ps7_0/Data] [get_bd_addr_segs video_capture/v_tc_0/ctrl/Reg]
assign_bd_address -offset 0x43C20000 -range 64K -target_address_space [get_bd_addr_spaces ps7_0/Data] [get_bd_addr_segs axi_uart16550_0/S_AXI/Reg]
assign_bd_address -offset 0x43C30000 -range 64K -target_address_space [get_bd_addr_spaces ps7_0/Data] [get_bd_addr_segs xvc_jtag/debug_bridge_axi2jtag/S_AXI/Reg0]
assign_bd_address -offset 0x60000000 -range 32M -target_address_space [get_bd_addr_spaces ps7_0/Data] [get_bd_addr_segs axi_emc_0/S_AXI_MEM/Mem0]
assign_bd_address -offset 0x00000000 -range 512M -target_address_space [get_bd_addr_spaces video_capture/v_frmbuf_wr_0/Data_m_axi_mm_video] [get_bd_addr_segs ps7_0/S_AXI_HP1/HP1_DDR_LOWOCM]

validate_bd_design
save_bd_design
